# Altium schematic sheet PowerPC_AMCC_PPC405CR_LCD.SchDoc
size B; DocumentNumber: 1; SheetNumber: 1; SheetTotal: 1
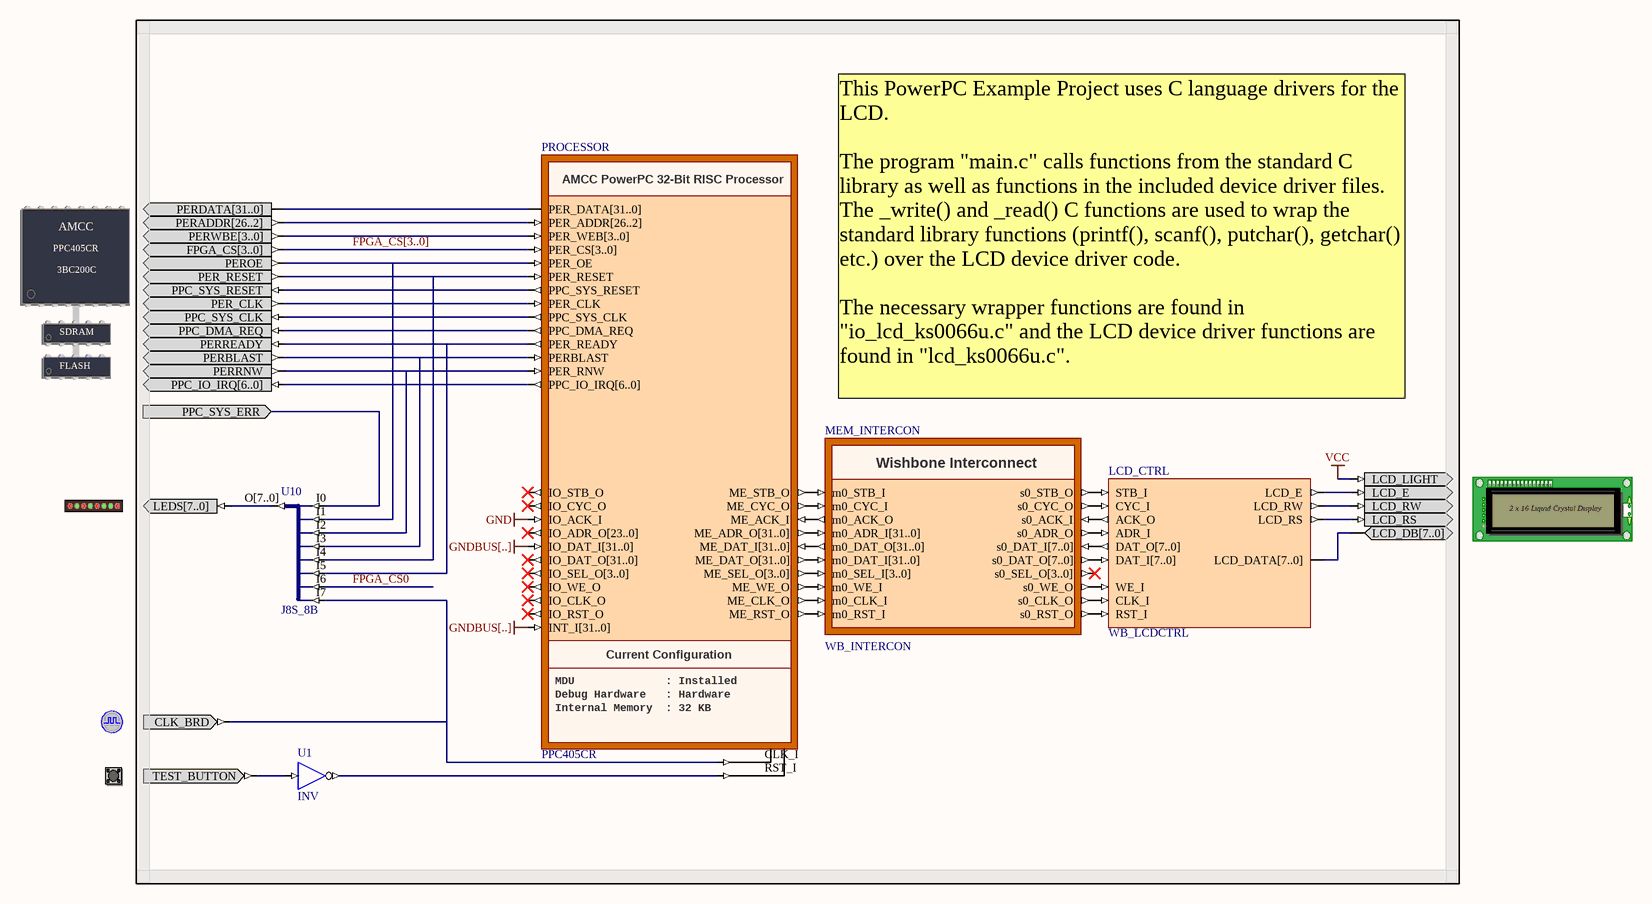
[diagram p0: PowerPC_AMCC_PPC405CR_LCD.SchDoc]

## Parts
(Parts that share a designator on the sheet are numbered #1, #2 ... from top to bottom, then left to right.)
?#1  PROCESSOR_PPC405CR  (value not drawn)
?#2  LCD  (value not drawn)
?#3  LED  (value not drawn)
?#4  CLOCK_BOARD  (value not drawn)
?#5  TEST_BUTTON  (value not drawn)
LCD_CTRL  WB_LCDCTRL
MEM_INTERCON  WB_INTERCON
PROCESSOR  PPC405CR
U1  INV
U10  J8S_8B

## Ports
PPC_SYS_ERR (in)

## Nets
GND: PROCESSOR.IO_ACK_I
GNDBUS[..]: PROCESSOR.INT_I[31..0] PROCESSOR.IO_DAT_I[31..0]
VCC: ?#2.LCD_LIGHT
FPGA_CS0: U10.I6
FPGA_CS[3..0]: ?#1.FPGA_CS[3..0] PROCESSOR.PER_CS[3..0]
PPC_SYS_ERR: U10.I0 ; port PPC_SYS_ERR
Net?#1_PER_CLK: ?#1.PER_CLK PROCESSOR.PER_CLK
Net?#1_PER_RESET: ?#1.PER_RESET PROCESSOR.PER_RESET U10.I4
Net?#1_PERADDR[26..2]: ?#1.PERADDR[26..2] PROCESSOR.PER_ADDR[26..2]
Net?#1_PERBLAST: ?#1.PERBLAST PROCESSOR.PERBLAST U10.I3
Net?#1_PERDATA[31..0]: ?#1.PERDATA[31..0] PROCESSOR.PER_DATA[31..0]
Net?#1_PEROE: ?#1.PEROE PROCESSOR.PER_OE U10.I1
Net?#1_PERREADY: ?#1.PERREADY PROCESSOR.PER_READY U10.I5
Net?#1_PERRNW: ?#1.PERRNW PROCESSOR.PER_RNW U10.I2
Net?#1_PERWBE[3..0]: ?#1.PERWBE[3..0] PROCESSOR.PER_WEB[3..0]
Net?#1_PPC_DMA_REQ: ?#1.PPC_DMA_REQ PROCESSOR.PPC_DMA_REQ
Net?#1_PPC_IO_IRQ[6..0]: ?#1.PPC_IO_IRQ[6..0] PROCESSOR.PPC_IO_IRQ[6..0]
Net?#1_PPC_SYS_CLK: ?#1.PPC_SYS_CLK PROCESSOR.PPC_SYS_CLK
Net?#1_PPC_SYS_RESET: ?#1.PPC_SYS_RESET PROCESSOR.PPC_SYS_RESET
Net?#2_LCD_DB[7..0]: ?#2.LCD_DB[7..0] LCD_CTRL.LCD_DATA[7..0]
Net?#2_LCD_E: ?#2.LCD_E LCD_CTRL.LCD_E
Net?#2_LCD_RS: ?#2.LCD_RS LCD_CTRL.LCD_RS
Net?#2_LCD_RW: ?#2.LCD_RW LCD_CTRL.LCD_RW
Net?#3_LEDS[7..0]: ?#3.LEDS[7..0] U10.O[7..0]
Net?#4_CLK_BRD: ?#4.CLK_BRD PROCESSOR.CLK_I U10.I7
Net?#5_TEST_BUTTON: ?#5.TEST_BUTTON U1.I
NetLCD_CTRL_ACK_O: LCD_CTRL.ACK_O MEM_INTERCON.s0_ACK_I
NetLCD_CTRL_ADR_I: LCD_CTRL.ADR_I MEM_INTERCON.s0_ADR_O
NetLCD_CTRL_CLK_I: LCD_CTRL.CLK_I MEM_INTERCON.s0_CLK_O
NetLCD_CTRL_CYC_I: LCD_CTRL.CYC_I MEM_INTERCON.s0_CYC_O
NetLCD_CTRL_DAT_I[7..0]: LCD_CTRL.DAT_I[7..0] MEM_INTERCON.s0_DAT_O[7..0]
NetLCD_CTRL_DAT_O[7..0]: LCD_CTRL.DAT_O[7..0] MEM_INTERCON.s0_DAT_I[7..0]
NetLCD_CTRL_RST_I: LCD_CTRL.RST_I MEM_INTERCON.s0_RST_O
NetLCD_CTRL_STB_I: LCD_CTRL.STB_I MEM_INTERCON.s0_STB_O
NetLCD_CTRL_WE_I: LCD_CTRL.WE_I MEM_INTERCON.s0_WE_O
NetMEM_INTERCON_m0_ACK_O: MEM_INTERCON.m0_ACK_O PROCESSOR.ME_ACK_I
NetMEM_INTERCON_m0_ADR_I[31..0]: MEM_INTERCON.m0_ADR_I[31..0] PROCESSOR.ME_ADR_O[31..0]
NetMEM_INTERCON_m0_CLK_I: MEM_INTERCON.m0_CLK_I PROCESSOR.ME_CLK_O
NetMEM_INTERCON_m0_CYC_I: MEM_INTERCON.m0_CYC_I PROCESSOR.ME_CYC_O
NetMEM_INTERCON_m0_DAT_I[31..0]: MEM_INTERCON.m0_DAT_I[31..0] PROCESSOR.ME_DAT_O[31..0]
NetMEM_INTERCON_m0_DAT_O[31..0]: MEM_INTERCON.m0_DAT_O[31..0] PROCESSOR.ME_DAT_I[31..0]
NetMEM_INTERCON_m0_RST_I: MEM_INTERCON.m0_RST_I PROCESSOR.ME_RST_O
NetMEM_INTERCON_m0_SEL_I[3..0]: MEM_INTERCON.m0_SEL_I[3..0] PROCESSOR.ME_SEL_O[3..0]
NetMEM_INTERCON_m0_STB_I: MEM_INTERCON.m0_STB_I PROCESSOR.ME_STB_O
NetMEM_INTERCON_m0_WE_I: MEM_INTERCON.m0_WE_I PROCESSOR.ME_WE_O
NetPROCESSOR_RST_I: PROCESSOR.RST_I U1.O

Not connected (* = marked no-connect by the designer): MEM_INTERCON s0_SEL_O[3..0]*; PROCESSOR IO_ADR_O[23..0]* IO_CLK_O* IO_CYC_O* IO_DAT_O[31..0]* IO_RST_O* IO_SEL_O[3..0]* IO_STB_O* IO_WE_O*

## Buses and harness runs
bus FPGA_CS[3..0]

## Notes on the sheet
- (near PROCESSOR) This PowerPC Example Project uses C language drivers for the LCD.
  The program "main.c" calls functions from the standard C library as well as functions in the included device driver files. The _write() and _read() C functions are used to wrap the standard library functions (printf(), scanf(), putchar(), getchar() etc.) over the LCD device driver code.
  The necessary wrapper functions are found in "io_lcd_ks0066u.c" and the LCD device driver functions are found in "lcd_ks0066u.c".
- Title
- Size:
- Date:
- B
- Number:
- Time:
- Revision:
- Sheet
- of
- File:
- (in symbol LCD) 2 x 16 Liquid Crystal Display
- (in symbol PPC405CR) AMCC PowerPC 32-Bit RISC Processor; Current Configuration; MDU              : Installed; Debug Hardware   : Hardware; Internal Memory  : 32 KB
- (in symbol PROCESSOR_PPC405CR) AMCC; PPC405CR; 3BC200C; SDRAM; FLASH
- (in symbol WB_INTERCON) Wishbone Interconnect

## Library data of the parts
?#1 = PROCESSOR_PPC405CR: AMCC PowerPC 405CR Embedded Processor; PortComponent: True; Published: 25-Aug-2005; Publisher: Altium Limited; HelpURL: https://www.amcc.com/MyAMCC/jsp/public/productDetail/product_detail.jsp?productID=PPC405CR
?#2 = LCD: Liquid Crystal Display; PortComponent: True; Published: 19-Nov-2003; Publisher: Altium Limited; HelpURL: TR0102 NanoBoard Technical Reference Manual - NB1.pdf#page=39
?#3 = LED: 8-Way LEDS; PortComponent: True; Published: 19-Nov-2003; Publisher: Altium Limited; HelpURL: TR0102 NanoBoard Technical Reference Manual - NB1.pdf#page=41
?#4 = CLOCK_BOARD: Global System Clock Supply; PortComponent: True; Published: 19-Nov-2003; Publisher: Altium Limited; HelpURL: TR0102 NanoBoard Technical Reference Manual - NB1.pdf#page=29
?#5 = TEST_BUTTON: Test Button; PortComponent: True; Published: 19-Nov-2003; Publisher: Altium Limited; HelpURL: TR0102 NanoBoard Technical Reference Manual - NB1.pdf#page=41
LCD_CTRL = WB_LCDCTRL: LCD Controller Wishbone; ArchiveName: GENERIC; Published: 9-Dec-2004; Publisher: Altium Limited; ComponentLink1Description: Core &Resource Usage; ComponentLink1URL: CR0139 FPGA Peripheral Resource Usage.pdf#page=56; LastRevisionNo: 1.00.00
MEM_INTERCON = WB_INTERCON: Configurable Wishbone Interconnect; ConfigurationParameters: {}Version[1.0]{}UnusedInterrupts[2]{}MasterAddressBits[0]{}Name0[LCD]{}Kind0[2]{}SpaceAfter0[4]{}Address_Base0[16777216]{}Address_UsedRange0[1]{}Address_Bits0[1]{}Address_Mode0[1]{}Address_DecodeWidth0[1]{}DataWidth0[2]{}UsedInterrupts0[ ]; ComponentLink1Description: Core &Resource Usage; ComponentLink1URL: CR0139 FPGA Peripheral Resource Usage.pdf#page=52; HelpURL: CR0150 WB_INTERCON Configurable Wishbone Interconnect.pdf; LastRevisionNo: 1.00.00; Published: 9-Dec-2004; Publisher: Altium Limited; ConfiguratorName: WB_INTERCON
PROCESSOR = PPC405CR: AMCC PowerPC PPC405 RISC Processor; ChildModel1: TSK3000A_MCU; Nexus_JTAG_Device: False; Nexus_Core: Processor_Hard; Nexus_JTAG_Order: 0; ChildModel2: TSK3000A_MDU; ChildModel3: TSK3000A_OCDS; ChildModel4: TSK3000A_Shift_Barrel; ChildModel5: TSK3000A_Shift_Sequential; ChildModel6: Mult_32x32; ConfigurationParameters: {}Version[1.0]{}Option_Processor[2]{}Option_Memory[5]{}Option_MDU[0]{}Option_OCDS[2]{}Option_Shifter[0]{}Option_InterruptCount[32]{}Option_DebugWhenReset[0]{}; ChildModel7: m33x33; ConfiguratorName: FPGA_MCU32; Memory_Configuration: Record[PERIPHERAL]{}ComponentDesignator[LCD]{}Memory_Depth[0x0002]{}Memory_UsageType[ram]{}ProgramDownloadAddress[0x1000000]{}Memory_BusType[PPC:local_bus]{}Memory_Mau[8]{}Memory_MatchedComponent[]{}Memory_Description[U4]{}Memory_FillBitPattern[]{}Memory_Interrupts[]{n}Record[CODE_EXPORT]{}ExportType[1]{n}Record[NEXUS_CORE]{}ComponentDesignator[U2]{}Memory_Depth[16384]{}Memory_UsageType[rom]{}ProgramDownloadAddress[0x00000000]{}Memory_BusType[PPC:local_bus]{}Memory_Mau[8]{}Memory_MatchedComponent[]{}Memory_Description[]{}Memory_FillBitPattern[]{}Memory_Interrupts[]{n}Record[NEXUS_CORE]{}ComponentDesignator[RAM]{}Memory_Depth[16k]{}Memory_UsageType[ram]{}ProgramDownloadAddress[16k]{}Memory_BusType[PPC:local_bus]{}Memory_Mau[8]{}Memory_MatchedComponent[]{}Memory_Description[U4]{}Memory_FillBitPattern[]{}Memory_Interrupts[]{n}; ProgramLogicalTopAddress: 0; ComponentLink1Description: Core &Resource Usage; ComponentLink1URL: CR0140 FPGA Processor Resource Usage.pdf#page=2; LastRevisionNo: 1.00.00; Published: 25-Aug-2005; Publisher: Altium Limited; ComponentLink2Description: Embedded &Tools Guide; ComponentLink2URL: GU0110 Using the PowerPC Embedded Tools.pdf; ComponentLink3Description: Embedded T&echnical References; ComponentLink3URL: TR0108 PowerPC Embedded Tools Reference.pdf
U1 = INV: Inverter; FunctionalClass: Logic Primitive; ArchiveName: GENERIC; VHDLIB_SIM: GENERIC_LIB; Published: 29-Jan-2004; Publisher: Altium Limited; XilinxEquivalent: INV; LastRevisionNo: 1.00.00; HelpURL: CR0118 FPGA Generic Library Guide.pdf#page=291; ComponentLink1URL: CR0136 FPGA Logic Primitive Resource Usage.pdf#page=61; ComponentLink1Description: Core &Resource Usage; SubClass: INV
U10 = J8S_8B: 8 Single pin inputs to single 8-Bit output bus; FunctionalClass: Bus Joiner; PortSize: 8; ArchiveName: GENERIC; VHDLIB_SIM: GENERIC_LIB; Published: 29-Jan-2004; Publisher: Altium Limited; LastRevisionNo: 1.00.00; HelpURL: CR0118 FPGA Generic Library Guide.pdf#page=306; ComponentLink1URL: CR0126 FPGA Bus Joiner Resource Usage.pdf#page=28; ComponentLink1Description: Core &Resource Usage